# EAGLE schematic meuRelogio (EAGLE 9.6.2)
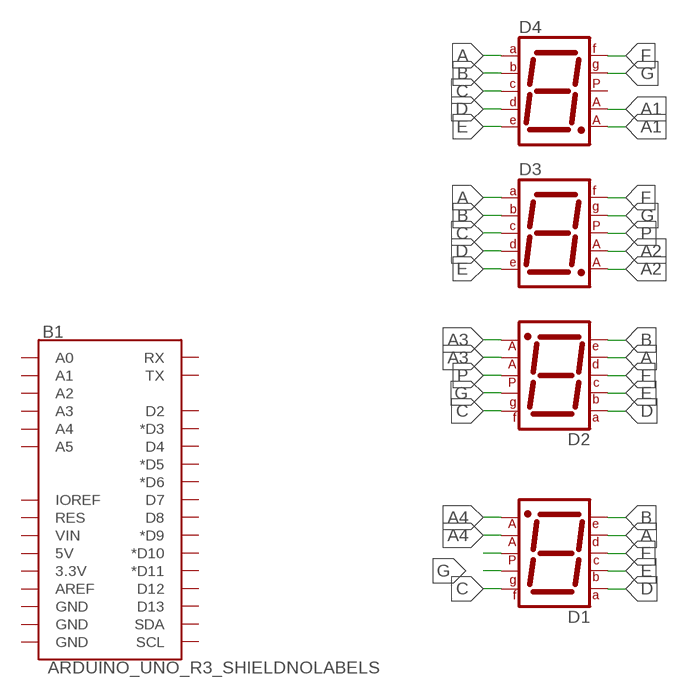
[diagram p0: schematic, sheet 1]

## Parts
B1  ARDUINO_UNO_R3_SHIELDNOLABELS  [UNO_R3_SHIELD_NOLABELS]
D1  7SEG-CA  [7SEG-13]
D2  7SEG-CA  [7SEG-13]
D3  7SEG-CA  [7SEG-13]
D4  7SEG-CA  [7SEG-13]

## Nets
A: D1.2(D) D2.2(D) D3.7(A) D4.7(A)
A1: D4.3(CA1) D4.8(CA2)
A2: D3.3(CA1) D3.8(CA2)
A3: D2.3(CA1) D2.8(CA2)
A4: D1.3(CA1) D1.8(CA2)
B: D1.1(E) D2.1(E) D3.6(B) D4.6(B)
C: D1.9(F) D2.9(F) D3.4(C) D4.4(C)
D: D1.7(A) D2.7(A) D3.2(D) D4.2(D)
E: D1.6(B) D2.6(B) D3.1(E) D4.1(E)
F: D1.4(C) D2.4(C) D3.9(F) D4.9(F)
G: D1.10(G) D2.10(G) D3.10(G) D4.10(G)
N$3: D1.5(DP)
P: D2.5(DP) D3.5(DP)
Unconnected: B1.3.3V B1.5V B1.A0 B1.A1 B1.A2 B1.A3 B1.A4 B1.A5 B1.AREF B1.D2 B1.D3(*D3) B1.D4 B1.D5(*D5) B1.D6(*D6) B1.D7 B1.D8 B1.D9(*D9) B1.D10(*D10) B1.D11(*D11) B1.D12 B1.D13 B1.GND@0(GND) B1.GND@1(GND) B1.GND@2(GND) B1.IOREF B1.RES B1.RX B1.SCL B1.SDA B1.TX B1.VIN D4.5(DP)

## Library data of the parts
B1 = SparkFun-Boards:ARDUINO_UNO_R3_SHIELD: Arduino R3 Shield Footprint Shield form compatible with the Arduino Uno R3. SparkFun Products: MG2639 Cellular Shield <https://www.sparkfun.com/products/13120> MIDI Shield <https://www.sparkfun.com/products/12898> R3 Stackable Headers Kit <https://www.sparkfun.com/products/11417>
D1-D4 = special:7SEG-CA: 7-segment DISPLAY single anode, 13 mm